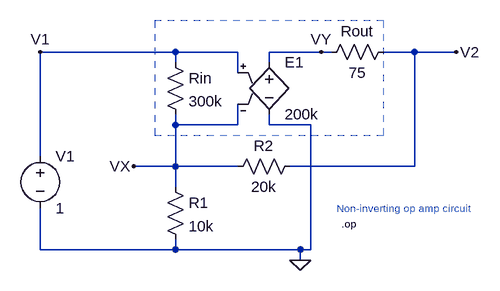
[diagram p0: schematic opamp2.asc]
opamp2.asc, the LTspice schematic file:
Version 4
SHEET 1 880 680
WIRE 144 16 -64 16
WIRE 240 16 144 16
WIRE 368 16 288 16
WIRE 384 16 368 16
WIRE 512 16 464 16
WIRE 576 16 512 16
WIRE 144 32 144 16
WIRE 288 32 288 16
WIRE 240 48 240 16
WIRE 144 128 144 112
WIRE 240 128 240 96
WIRE 240 128 144 128
WIRE 288 128 288 112
WIRE 352 128 288 128
WIRE -64 176 -64 16
WIRE 144 192 144 128
WIRE 144 192 80 192
WIRE 240 192 144 192
WIRE 512 192 512 16
WIRE 512 192 320 192
WIRE 144 224 144 192
WIRE -64 320 -64 256
WIRE 144 320 144 304
WIRE 144 320 -64 320
WIRE 336 320 144 320
WIRE 352 320 352 128
WIRE 352 320 336 320
WIRE 336 336 336 320
FLAG 336 336 0
FLAG 576 16 V2
FLAG 80 192 VX
FLAG 368 16 VY
FLAG -64 16 V1
DATAFLAG -16 16 ""
DATAFLAG 544 16 ""
DATAFLAG 144 192 ""
DATAFLAG 304 16 ""
SYMBOL res 128 208 R0
SYMATTR InstName R1
SYMATTR Value 10k
SYMBOL res 336 176 R90
WINDOW 0 0 56 VBottom 2
WINDOW 3 32 56 VTop 2
SYMATTR InstName R2
SYMATTR Value 20k
SYMBOL voltage -64 160 R0
WINDOW 123 0 0 Left 0
WINDOW 39 0 0 Left 0
SYMATTR InstName V1
SYMATTR Value 1
SYMBOL e 288 16 R0
SYMATTR InstName E1
SYMATTR Value 200k
SYMBOL res 480 0 R90
WINDOW 0 0 56 VBottom 2
WINDOW 3 32 56 VTop 2
SYMATTR InstName Rout
SYMATTR Value 75
SYMBOL res 128 16 R0
SYMATTR InstName Rin
SYMATTR Value 300k
TEXT 400 280 Left 1 !.op
TEXT 392 256 Left 1 ;Non-inverting op amp circuit
RECTANGLE Normal 464 -32 112 144 2

The netlist it stands for:
* opamp2.asc
R1 VX 0 10k
R2 V2 VX 20k
V1 V1 0 1
E1 VY 0 V1 VX 200k
Rout V2 VY 75
Rin V1 VX 300k
.op
* Non-inverting op amp circuit
.backanno
.end

* Results of the author's LTspice run, read from the files saved beside the schematic
* Operating Point:
*   V(vx) = 1 V
*   V(v2) = 3 V
*   V(v1) = 1 V
*   V(vy) = 3.007 V
*   I(Rin) = 50.12 pA
*   I(Rout) = -100 µA
*   I(R2) = 100 µA
*   I(R1) = 100 µA
*   I(E1) = -100 µA
*   I(V1) = -50.12 pA